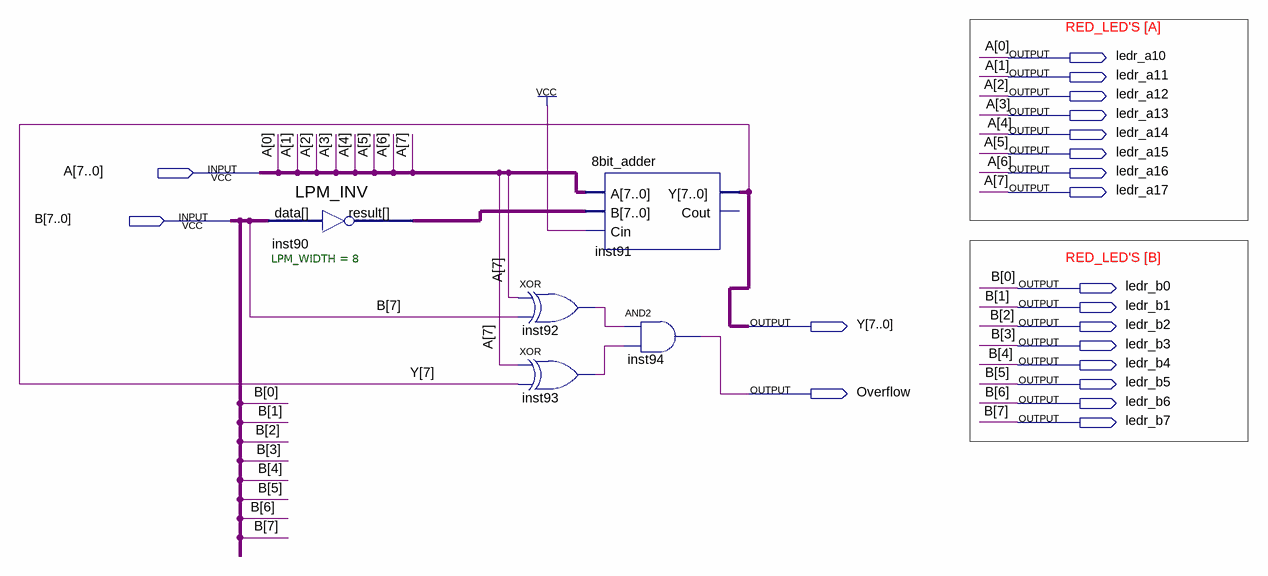
[diagram p0: schematic sheet]
// Quartus schematic substract.bdf as structural Verilog: 5 symbols, 20 pins
module substract (
  input  [7:0] A,
  input  [7:0] B,
  output ledr_a10,
  output ledr_a11,
  output ledr_a12,
  output ledr_a13,
  output ledr_a14,
  output ledr_a15,
  output ledr_a16,
  output ledr_a17,
  output ledr_b0,
  output ledr_b1,
  output [7:0] Y,
  output ledr_b2,
  output ledr_b3,
  output ledr_b4,
  output ledr_b5,
  output Overflow,
  output ledr_b6,
  output ledr_b7
);

  wire inst92_out, inst93_out;
  wire [7:0] inst90_result;

  LPM_INV #(.LPM_WIDTH(8)) inst90 (.data(B), .result(inst90_result));
  xor inst92 (inst92_out, A[7], B[7]);
  xor inst93 (inst93_out, A[7], Y[7]);
  \8bit_adder  inst91 (.A(A), .B(inst90_result), .Cin(1'b1), .Y(Y));  // open: Cout
  and inst94 (Overflow, inst92_out, inst93_out);

  assign ledr_a10 = A[0];
  assign ledr_a11 = A[1];
  assign ledr_a12 = A[2];
  assign ledr_a13 = A[3];
  assign ledr_a14 = A[4];
  assign ledr_a15 = A[5];
  assign ledr_a16 = A[6];
  assign ledr_a17 = A[7];
  assign ledr_b0 = B[0];
  assign ledr_b1 = B[1];
  assign ledr_b2 = B[2];
  assign ledr_b3 = B[3];
  assign ledr_b4 = B[4];
  assign ledr_b5 = B[5];
  assign ledr_b6 = B[6];
  assign ledr_b7 = B[7];

  // Notes on the sheet:
  //   RED_LED'S [A]
  //   RED_LED'S [B]
endmodule
